# EAGLE design main (EAGLE 9.2.0)
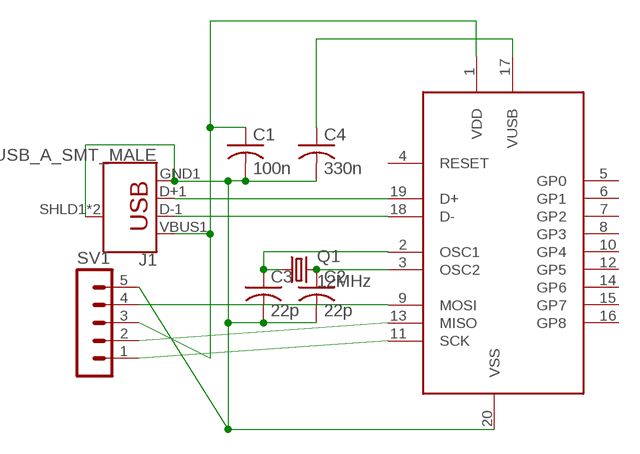
[diagram p0: schematic, sheet 1]

## Parts
C1  100n  C-USC0805  [C0805]
C2  22p  C-USC0603  [C0603]
C3  22p  C-USC0603  [C0603]
C4  330n  C-USC0603  [C0603]
J1  USB_A_SMT_MALE  [USB-A-SMT-MALE]
Q1  12MHz  CRYSTALHC49U-V  [HC49U-V]
SV1  MA05-1  [MA05-1]
U$1  MCP2210  [SOIC20_GENERIC]

## Nets
GND: C1.2 C2.2 C3.2 C4.2 J1.GND1(GND) J1.SHLD1(SHIELD) J1.SHLD2(SHIELD) SV1.5 U$1.20(VSS)
N$1: J1.D+1(D+) U$1.19(D+)
N$2: J1.D-1(D-) U$1.18(D-)
N$4: C1.1 J1.VBUS1(VBUS) SV1.3 U$1.1(VDD)
N$5: C3.1 Q1.1 U$1.2(OSC1)
N$6: C2.1 Q1.2 U$1.3(OSC2)
N$7: C4.1 U$1.17(VUSB)
N$13: SV1.1 U$1.11(SCK)
N$14: SV1.2 U$1.13(MISO)
N$15: SV1.4 U$1.9(MOSI)
Unconnected: U$1.4(RESET) U$1.5(GP0) U$1.6(GP1) U$1.7(GP2) U$1.8(GP3) U$1.10(GP4) U$1.12(GP5) U$1.14(GP6) U$1.15(GP7) U$1.16(GP8)

## Library data of the parts
C1-C4 = rcl:C-US: CAPACITOR, American symbol; SPICEPREFIX: C
J1 = SparkFun-Connectors:USB_A: USB-A Connector Male and female variants, as well as PTH and SMT variants SparkFun Products: SparkFun XBee Explorer Dongle <https://www.sparkfun.com/products/11697> PTH Male SparkFun MicroView-USB Programmer <https://www.sparkfun.com/products/12924> SMT Male SparkFun USB Type A Female Breakout <https://www.sparkfun.com/products/12700> SMT Female; PROD_ID: CONN-11499
Q1 = crystal:CRYSTAL: CRYSTAL; OC_FARNELL: 1666969; OC_NEWARK: unknown
SV1 = con-lstb:MA05-1: PIN HEADER; OC_FARNELL: unknown; OC_NEWARK: unknown
U$1 = 7_segment_lib:MCP2210

## Board
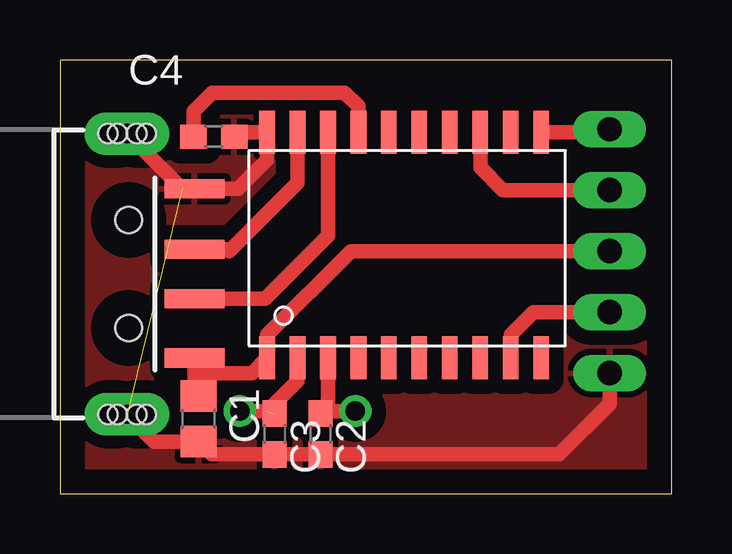
[diagram p1: board, top side]
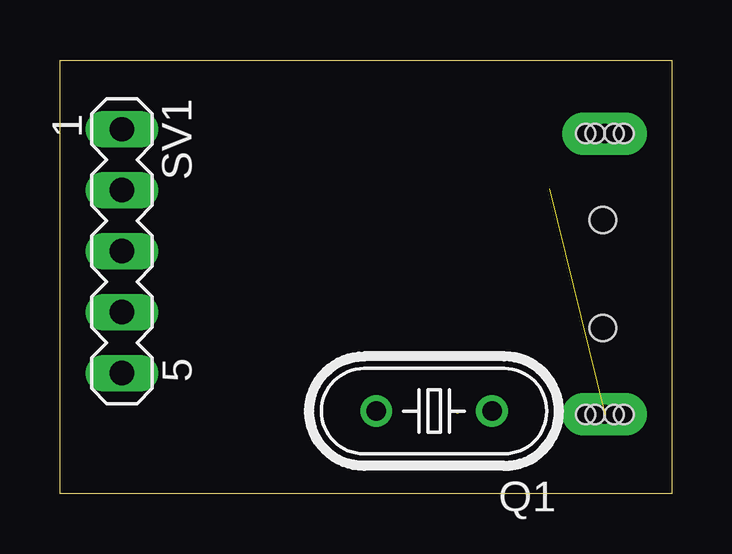
[diagram p2: board, bottom side, seen from below]

Size 25.51 x 18.07 mm. Coordinates in mm from the lower left corner, seen from the top.
Outline: 0,0 25.51,0 25.51,18.07 0,18.07 0,0
Copper layers (1*16): Top 0.035mm / dielectric 1.5mm / Bottom 0.035mm
Design rules "default": minimum track width 6mil, minimum drill 0.35mm, track to track 6mil, track to pad 6mil, pad to pad 6mil, via to via 6mil, smd to smd 6mil, copper to edge 40mil, drill to drill 6mil, minimum pad ring 10mil, minimum via ring 8mil, stop-mask expansion 4mil, vias tented up to drill 0mil, thermal gap 10mil

### Footprints (pad centres in the part's own frame; a part is rotated, then mirrored left to right if it is on the bottom)
C0805 = smd 1.3 x 1.5: 1 -0.95,0; 2 0.95,0
C0603 = smd 1.1 x 1: 1 -0.85,0; 2 0.85,0
USB-A-SMT-MALE = smd 2.5 x 0.8: D+1 10.95,1.027; D-1 10.95,-1.027; GND1 10.95,3.551; VBUS1 10.95,-3.5 | drill 0.8 pad 1.778 long: SHLD1 8.13,-5.85; SHLD2 8.13,5.85 | hole 1.1: 8.2,2.25; 8.2,-2.25 | hole 0.8: 8.53,-5.85; 8.93,-5.85; 7.73,-5.85; 7.33,-5.85; 8.53,5.85; 8.93,5.85; 7.73,5.85; 7.33,5.85
HC49U-V = drill 0.813: 1 -2.413,0; 2 2.413,0
MA05-1 = drill 1.016 long: 1 -5.08,0; 2 -2.54,0; 3 0,0; 4 2.54,0; 5 5.08,0
SOIC20_GENERIC = smd 1.8 x 0.65: 1 -5.08,6.35; 2 -5.08,5.08; 3 -5.08,3.81; 4 -5.08,2.54; 5 -5.08,1.27; 6 -5.08,0; 7 -5.08,-1.27; 8 -5.08,-2.54; 9 -5.08,-3.81; 10 -5.08,-5.08; 11 4.32,-5.08; 12 4.32,-3.81; 13 4.32,-2.54; 14 4.32,-1.27; 15 4.32,0; 16 4.32,1.27; 17 4.32,2.54; 18 4.32,3.81; 19 4.32,5.08; 20 4.32,6.35

### Placement (x,y rotation side)
C1  5.78,3.12 270 top
C2  10.86,2.49 270 top
C3  8.95,2.49 270 top
C4  6.41,14.87 0 top
J1  -5.33,9.16 0 top
Q1  9.91,3.44 180 bottom
SV1  22.92,10.11 270 bottom
U$1  14.99,10.74 90 top

### Tracks (layer width: path | path; a pad name or v marks a point on that pad's centre or on a via)
GND  (1 unrouted)
  Top 0.61: 2.8,14.75 J1.SHLD2 5.1,12.71 J1.GND1 7.42,12.71 8.64,13.92 U$1.20 7.46,15.06 C4.2 | J1.SHLD1 3.93,2.17 C1.2 6.31,1.64 C3.2 C2.2 20.8,1.64 22.92,3.76 SV1.5
  pour Top (isolate 0.61): -0.1,18.1 25.7,18.1 25.7,-0.14 -0.1,-0.14
N$1
  Top 0.61: U$1.19 9.91,12.97 7.05,10.11 6.97,10.18 J1.D+1
N$2
  Top 0.61: J1.D-1 8.56,8.13 11.18,10.74 U$1.18
N$4
  Top 0.61: C1.1 5.62,4.24 5.62,5.03 | 5.62,5.03 J1.VBUS1 | 5.62,5.03 8,5.03 U$1.1 8.64,6.62 12.13,10.11 SV1.3
N$5  (1 unrouted)
  Top 0.61: Q1.1 8.64,3.44 9.91,4.71 U$1.2
N$6
  Top 0.61: U$1.3 11.18,3.66 | 11.18,3.66 C2.1 | Q1.2 11.39,3.44 11.18,3.66
N$7
  Top 0.61: U$1.17 12.45,16.14 11.87,16.71 6.35,16.71 5.56,15.93 C4.1
N$13
  Top 0.61: U$1.11 22.8,15.06 SV1.1
N$14
  Top 0.61: U$1.13 17.53,13.6 18.48,12.65 SV1.2
N$15
  Top 0.61: SV1.4 19.75,7.57 18.8,6.62 U$1.9